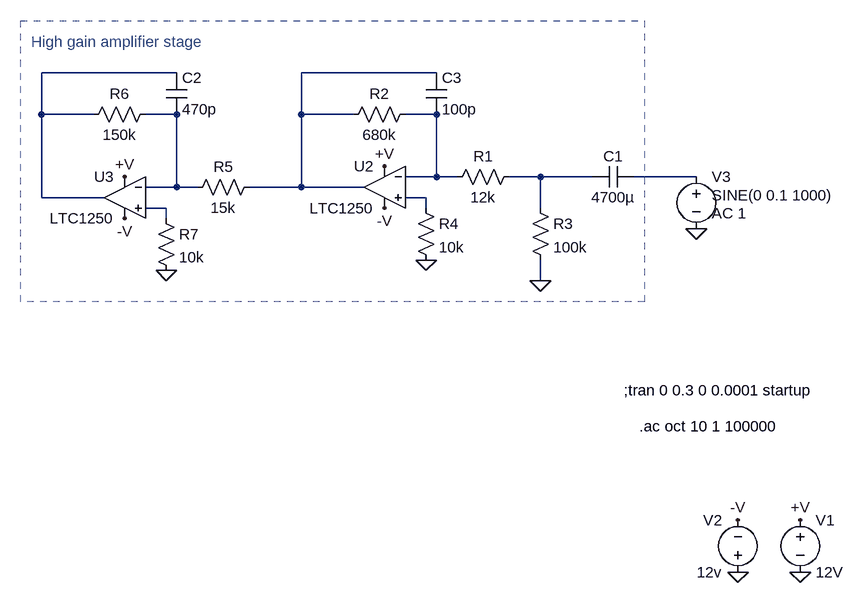
[diagram p0: schematic amp_stage.asc]
amp_stage.asc, the LTspice schematic file:
Version 4.1
SHEET 1 928 680
WIRE -192 -320 -400 -320
WIRE 208 -320 0 -320
WIRE -400 -256 -400 -320
WIRE -320 -256 -400 -256
WIRE -192 -256 -240 -256
WIRE 0 -256 0 -320
WIRE 80 -256 0 -256
WIRE 208 -256 160 -256
WIRE 208 -160 208 -256
WIRE 208 -160 160 -160
WIRE 240 -160 208 -160
WIRE 368 -160 320 -160
WIRE 448 -160 368 -160
WIRE 608 -160 512 -160
WIRE -192 -144 -192 -256
WIRE -192 -144 -240 -144
WIRE -160 -144 -192 -144
WIRE 0 -144 0 -256
WIRE 0 -144 -80 -144
WIRE 96 -144 0 -144
WIRE -400 -128 -400 -256
WIRE -304 -128 -400 -128
WIRE 192 -128 160 -128
WIRE -208 -112 -240 -112
WIRE 192 -112 192 -128
WIRE 368 -112 368 -160
WIRE -208 -96 -208 -112
WIRE 368 0 368 -32
FLAG 768 448 0
FLAG 768 368 +V
FLAG 672 448 0
FLAG 672 368 -V
FLAG 128 -176 +V
FLAG 128 -112 -V
FLAG 368 0 0
FLAG 192 -32 0
FLAG -272 -160 +V
FLAG -272 -96 -V
FLAG -208 -16 0
FLAG 608 -80 0
SYMBOL voltage 768 352 R0
WINDOW 123 0 0 Left 0
WINDOW 39 0 0 Left 0
SYMATTR InstName V1
SYMATTR Value 12V
SYMBOL voltage 672 464 R180
WINDOW 0 24 96 Left 2
WINDOW 3 24 16 Left 2
WINDOW 123 0 0 Left 0
WINDOW 39 0 0 Left 0
SYMATTR InstName V2
SYMATTR Value 12v
SYMBOL res 336 -176 R90
WINDOW 0 0 56 VBottom 2
WINDOW 3 32 56 VTop 2
SYMATTR InstName R1
SYMATTR Value 12k
SYMBOL res 176 -272 R90
WINDOW 0 0 56 VBottom 2
WINDOW 3 32 56 VTop 2
SYMATTR InstName R2
SYMATTR Value 680k
SYMBOL res 352 -128 R0
SYMATTR InstName R3
SYMATTR Value 100k
SYMBOL res 176 -128 R0
SYMATTR InstName R4
SYMATTR Value 10k
SYMBOL res -64 -160 R90
WINDOW 0 0 56 VBottom 2
WINDOW 3 32 56 VTop 2
SYMATTR InstName R5
SYMATTR Value 15k
SYMBOL res -224 -272 R90
WINDOW 0 0 56 VBottom 2
WINDOW 3 32 56 VTop 2
SYMATTR InstName R6
SYMATTR Value 150k
SYMBOL res -224 -112 R0
SYMATTR InstName R7
SYMATTR Value 10k
SYMBOL cap 512 -176 R90
WINDOW 0 0 32 VBottom 2
WINDOW 3 32 32 VTop 2
SYMATTR InstName C1
SYMATTR Value 4700µ
SYMBOL Opamps\\LTC1250 128 -208 M0
SYMATTR InstName U2
SYMBOL Opamps\\LTC1250 -272 -192 M0
SYMATTR InstName U3
SYMBOL cap -208 -256 M180
WINDOW 0 24 56 Left 2
WINDOW 3 24 8 Left 2
SYMATTR InstName C2
SYMATTR Value 470p
SYMBOL cap 192 -256 M180
WINDOW 0 24 56 Left 2
WINDOW 3 24 8 Left 2
SYMATTR InstName C3
SYMATTR Value 100p
SYMBOL voltage 608 -176 R0
WINDOW 3 24 44 Left 2
WINDOW 123 24 72 Left 2
WINDOW 39 0 0 Left 0
SYMATTR Value SINE(0 0.1 1000)
SYMATTR Value2 AC 1
SYMATTR InstName V3
TEXT 496 168 Left 2 !;tran 0 0.3 0 0.0001 startup
TEXT -416 -368 Left 2 ;High gain amplifier stage
TEXT 520 224 Left 2 !.ac oct 10 1 100000
RECTANGLE Normal 528 32 -432 -400 2

The netlist it stands for:
* amp_stage.asc
V1 +V 0 12V
V2 0 -V 12v
R1 N005 N004 12k
R2 N004 N002 680k
R3 N005 0 100k
R4 N007 0 10k
R5 N002 N003 15k
R6 N003 N001 150k
R7 N008 0 10k
C1 N006 N005 4700µ
X§U2 N007 N004 +V -V N002 LTC1250  ; pins In+ In- V+ V- OUT
X§U3 N008 N003 +V -V N001 LTC1250  ; pins In+ In- V+ V- OUT
C2 N003 N001 470p
C3 N004 N002 100p
V3 N006 0 SINE(0 0.1 1000) AC 1
;tran 0 0.3 0 0.0001 startup
* High gain amplifier stage
.ac oct 10 1 100000
.backanno
.end